# Altium schematic sheet Nmos.SchDoc
size A4; SheetNumber: 2; SheetTotal: 2
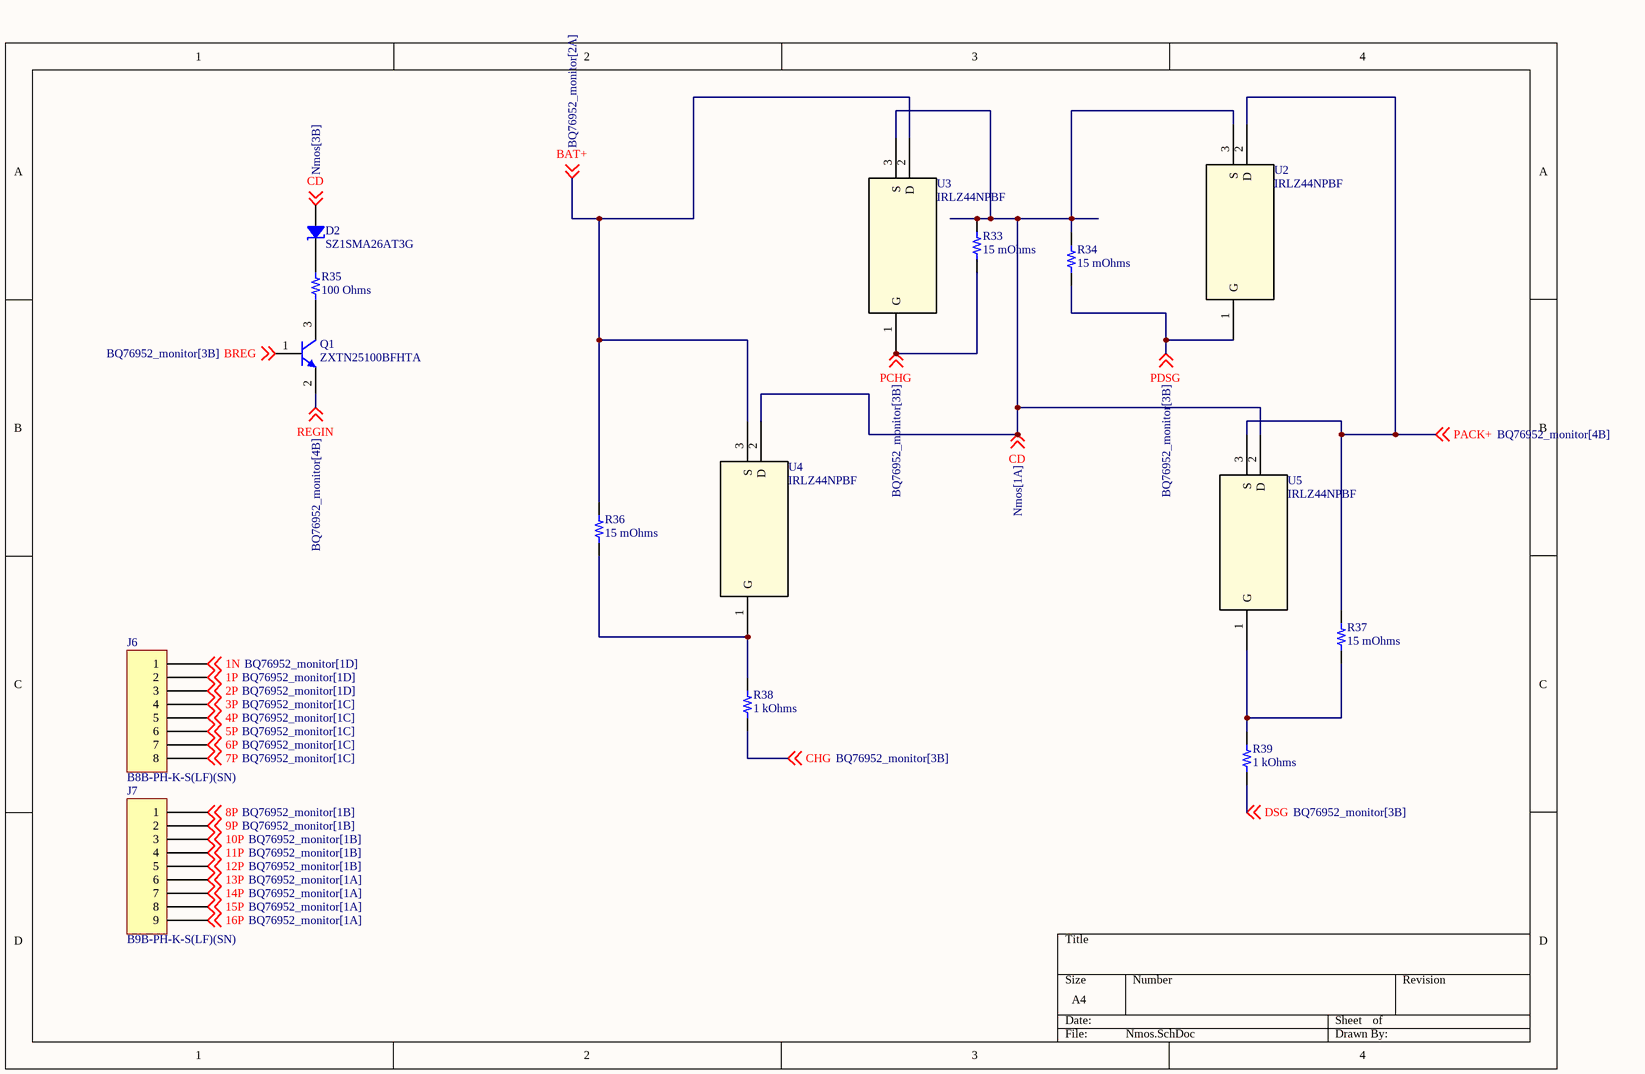
[diagram p0: Nmos.SchDoc]

## Parts
D2  SZ1SMA26AT3G  [DO214AC SMA]
J6  B8B-PH-K-S(LF)(SN)  [JST B8B-PH-K]
J7  B9B-PH-K-S(LF)(SN)  [JST B9B-PH-K]
Q1  ZXTN25100BFHTA  [DIODES SOT-23-3]
R33  15 mOhms  [RES 1206_3216]
R34  15 mOhms  [RES 1206_3216]
R35  100 Ohms  [RES 1206_3216]
R36  15 mOhms  [RES 1206_3216]
R37  15 mOhms  [RES 1206_3216]
R38  1 kOhms  [RES 1206_3216]
R39  1 kOhms  [RES 1206_3216]
U2  IRLZ44NPBF  [PG-TO220-3_INF]
U3  IRLZ44NPBF  [PG-TO220-3_INF]
U4  IRLZ44NPBF  [PG-TO220-3_INF]
U5  IRLZ44NPBF  [PG-TO220-3_INF]

## Nets
1N: J6.1 ; off-sheet 1N
1P: J6.2 ; off-sheet 1P
2P: J6.3 ; off-sheet 2P
3P: J6.4 ; off-sheet 3P
4P: J6.5 ; off-sheet 4P
5P: J6.6 ; off-sheet 5P
6P: J6.7 ; off-sheet 6P
7P: J6.8 ; off-sheet 7P
8P: J7.1 ; off-sheet 8P
9P: J7.2 ; off-sheet 9P
10P: J7.3 ; off-sheet 10P
11P: J7.4 ; off-sheet 11P
12P: J7.5 ; off-sheet 12P
13P: J7.6 ; off-sheet 13P
14P: J7.7 ; off-sheet 14P
15P: J7.8 ; off-sheet 15P
16P: J7.9 ; off-sheet 16P
BAT+: R36.2 U3.2(D) U4.3(S) ; off-sheet BAT+
BREG: Q1.1(B) ; off-sheet BREG
CD: D2.1 R33.2 R34.2 U2.3(S) U3.3(S) U4.2(D) U5.2(D) ; off-sheet CD
CHG: R38.1 ; off-sheet CHG
DSG: R39.1 ; off-sheet DSG
PACK+: R37.2 U2.2(D) U5.3(S) ; off-sheet PACK+
PCHG: R33.1 U3.1(G) ; off-sheet PCHG
PDSG: R34.1 U2.1(G) ; off-sheet PDSG
REGIN: Q1.2(E) ; off-sheet REGIN
NetD2_2: D2.2 R35.2
NetQ1_3: Q1.3(C) R35.1
NetR36_1: R36.1 R38.2 U4.1(G)
NetR37_1: R37.1 R39.2 U5.1(G)

## Library data of the parts
D2 = SZ1SMA26AT3G: TVS DIODE 26VWM 42.1VC SMA; Manufacturer: Littelfuse Inc.; Capacitance @ Frequency: 460pF @ 1MHz; Current - Peak Pulse (10/1000µs): 9.5A; Power Line Protection: No; Power - Peak Pulse: 400W; Type: Zener; Unidirectional Channels: 1; Voltage - Breakdown (Min): 28.9V; Voltage - Clamping (Max) @ Ipp: 42.1V; Voltage - Reverse Standoff (Typ): 26V; Part Number: SZ1SMA26AT3G; Applications: Automotive; ComponentLink1Description: Datasheet; ComponentLink1URL: https://www.littelfuse.com/~/media/electronics/datasheets/tvs_diodes/littelfuse_tvs_diode_sz1smaxxa_datasheet.pdf.pdf; ComponentLink2Description: DigiKey Link; ComponentLink2URL: https://www.digikey.com/en/products/detail/littelfuse-inc/SZ1SMA26AT3G/3062915; LastUpdated: 3.06.2024 19:57:20; Lifecycle Status: Active; Minimum Order: 1; Mounting Type: Surface Mount; Operating Temperature: -65°C ~ 150°C (TJ); Package / Case: DO-214AC, SMA; Packaging: TapeAndReel; PartId: 5569; Part Status: Active; Price: 0.16; Series: SZ1SMA; Supplier 1: DigiKey; Supplier Part Number 1: F11514CT-ND; Supplier Device Package: SMA
J6 = B8B-PH-K-S(LF)(SN): CONN HEADER VERT 8POS 2MM; Manufacturer: JST Sales America Inc.; Contact Length - Mating: 0.130" (3.30mm); Contact Length - Post: 0.134" (3.40mm); Current Rating (Amps): 2A; Material Flammability Rating: UL94 V-0; Number of Positions: 8; Number of Positions Loaded: All; Overall Contact Length: 0.333" (8.45mm); Pitch - Mating: 0.079" (2.00mm); Shrouding: Shrouded - 4 Wall; Style: Board to Cable/Wire; Voltage Rating: 100V; Part Number: B8B-PH-K-S(LF)(SN); ComponentLink1Description: Datasheet; ComponentLink1URL: http://www.jst-mfg.com/product/pdf/eng/ePH.pdf; ComponentLink2Description: DigiKey Link; ComponentLink2URL: http://digikey.com/product-detail/en/jst-sales-america-inc/B8B-PH-K-S-LF-SN/455-1710-ND/926617; Connector Type: Header; Contact Finish - Mating: Tin; Contact Finish - Post: Tin; Contact Material: Brass; Contact Shape: Square; Contact Type: Male Pin; Fastening Type: Detent Lock; Insulation Color: Natural; Insulation Height: 0.236" (6.00mm); Insulation Material: Polyamide (PA66), Nylon 6/6; LastUpdated: 12.01.2020 22:30:45; Lifecycle Status: Active; Minimum Order: 1; Mounting Type: Through Hole; Number of Rows: 1; Operating Temperature: -25°C ~ 85°C; Packaging: Bulk; PartId: 31; Part Status: Active; Price: 0.43; Series: PH; Supplier 1: DigiKey; Supplier Part Number 1: 455-1710-ND; Termination: Press-Fit, Solder
J7 = B9B-PH-K-S(LF)(SN): CONN HEADER VERT 9POS 2MM; Manufacturer: JST Sales America Inc.; Contact Length - Mating: 0.130" (3.30mm); Contact Length - Post: 0.134" (3.40mm); Current Rating (Amps): 2A; Material Flammability Rating: UL94 V-0; Number of Positions: 9; Number of Positions Loaded: All; Overall Contact Length: 0.333" (8.45mm); Pitch - Mating: 0.079" (2.00mm); Shrouding: Shrouded - 4 Wall; Style: Board to Cable/Wire; Voltage Rating: 100V; Part Number: B9B-PH-K-S(LF)(SN); ComponentLink1Description: Datasheet; ComponentLink1URL: http://www.jst-mfg.com/product/pdf/eng/ePH.pdf; ComponentLink2Description: DigiKey Link; ComponentLink2URL: http://digikey.com/product-detail/en/jst-sales-america-inc/B9B-PH-K-S-LF-SN/455-1711-ND/926618; Connector Type: Header; Contact Finish - Mating: Tin; Contact Finish - Post: Tin; Contact Material: Brass; Contact Shape: Square; Contact Type: Male Pin; Fastening Type: Detent Lock; Insulation Color: Natural; Insulation Height: 0.236" (6.00mm); Insulation Material: Polyamide (PA66), Nylon 6/6; LastUpdated: 12.01.2020 22:30:56; Lifecycle Status: Active; Minimum Order: 1; Mounting Type: Through Hole; Number of Rows: 1; Operating Temperature: -25°C ~ 85°C; Packaging: Bulk; PartId: 32; Part Status: Active; Price: 0.48; Series: PH; Supplier 1: DigiKey; Supplier Part Number 1: 455-1711-ND; Termination: Press-Fit, Solder
Q1 = ZXTN25100BFHTA: TRANS NPN 100V 3A SOT23-3; Manufacturer: Diodes Incorporated; Current - Collector Cutoff (Max): 50nA (ICBO); DC Current Gain (hFE) (Min) @ Ic, Vce: 100 @ 10mA, 2V; Frequency - Transition: 160MHz; Power - Max: 1.25 W; Vce Saturation (Max) @ Ib, Ic: 250mV @ 300mA, 3A; Part Number: ZXTN25100BFHTA; ComponentLink1Description: Datasheet; ComponentLink1URL: https://www.diodes.com/assets/Datasheets/ZXTN25100BFH.pdf; ComponentLink2Description: DigiKey Link; ComponentLink2URL: https://www.digikey.com/en/products/detail/diodes-incorporated/ZXTN25100BFHTA/1043596; Current - Collector (Ic) (Max): 3 A; LastUpdated: 3.06.2024 20:24:10; Lifecycle Status: Active; Minimum Order: 1; Mounting Type: Surface Mount; Operating Temperature: -55°C ~ 150°C (TJ); Package / Case: TO-236-3, SC-59, SOT-23-3; Packaging: TapeAndReel; PartId: 55; Part Status: Active; Price: 0.19; Series: -; Supplier 1: DigiKey; Supplier Part Number 1: ZXTN25100BFHCT-ND; Supplier Device Package: SOT-23-3; Transistor Type: NPN; Voltage - Collector Emitter Breakdown (Max): 100 V
R33 R34 R36 R37 = TLR2BPDTD15L0F75: RES 15M OHM 1% 1.5W 1206; Manufacturer: KOA Speer Electronics, Inc.; Temperature Coefficient: ±75ppm/°C; Part Number: TLR2BPDTD15L0F75; ComponentLink1Description: Datasheet; ComponentLink1URL: https://www.koaspeer.com/pdfs/TLR-2BW-2BP-2HW-3AP-3APS.pdf; ComponentLink2Description: DigiKey Link; ComponentLink2URL: https://www.digikey.com/en/products/detail/koa-speer-electronics-inc/TLR2BPDTD15L0F75/9856580; Composition: Metal Element; Device Package: 1206 (3216 Metric); Features: Automotive AEC-Q200, Current Sense; Height - Seated (Max): 0.032" (0.80mm); LastUpdated: 9.02.2024 20:53:01; Lifecycle Status: Active; Minimum Order: 1; Number of Terminations: 2; Operating Temperature: -65°C ~ 170°C; Package / Case: 1206 (3216 Metric); Packaging: TapeAndReel; PartId: 72235; Part Status: Active; Power (Watts): 1.5W; Price: 0.27; Ratings: AEC-Q200; Resistance: 15 mOhms; Series: TLR; Size / Dimension: 0.126" L x 0.063" W (3.20mm x 1.60mm); Supplier 1: DigiKey; Supplier Part Number 1: 2019-TLR2BPDTD15L0F75CT-ND; Supplier Device Package: 1206; Tolerance: ±1%; Value: 15 mOhms
R35 = RNCS1206BKE100R: RES 100 OHM 0.1% 1/8W 1206; Manufacturer: Stackpole Electronics Inc; Power (Watts): 0.125W, 1/8W; Temperature Coefficient: ±25ppm/°C; Part Number: RNCS1206BKE100R; ComponentLink1Description: Datasheet; ComponentLink1URL: https://www.seielect.com/catalog/sei-rncs_rnch.pdf; ComponentLink2Description: DigiKey Link; ComponentLink2URL: https://www.digikey.com/en/products/detail/stackpole-electronics-inc/RNCS1206BKE100R/1800111; Composition: Thin Film; Device Package: 1206 (3216 Metric); Features: Anti-Corrosive, Automotive AEC-Q200, Moisture Resistant; Height - Seated (Max): 0.026" (0.65mm); LastUpdated: 9.02.2024 20:54:46; Lifecycle Status: Active; Minimum Order: 1; Number of Terminations: 2; Operating Temperature: -55°C ~ 155°C; Package / Case: 1206 (3216 Metric); Packaging: TapeAndReel; PartId: 26857; Part Status: Active; Price: 0.08; Ratings: AEC-Q200; Resistance: 100 Ohms; Series: RNCS; Size / Dimension: 0.120" L x 0.061" W (3.05mm x 1.55mm); Supplier 1: DigiKey; Supplier Part Number 1: RNCS1206BKE100RCT-ND; Supplier Device Package: 1206; Tolerance: ±0.1%; Value: 100 Ohms
R38 R39 = CRGCQ1206F1K0: RES 1K OHM 1% 1/4W 1206; Manufacturer: TE Connectivity Passive Product; Power (Watts): 0.25W, 1/4W; Temperature Coefficient: ±100ppm/°C; Part Number: CRGCQ1206F1K0; ComponentLink1Description: Datasheet; ComponentLink1URL: https://www.te.com/commerce/DocumentDelivery/DDEController?Action=srchrtrv&DocNm=1773204-3&DocType=DS&DocLang=English; ComponentLink2Description: DigiKey Link; ComponentLink2URL: https://www.digikey.com/en/products/detail/te-connectivity-passive-product/CRGCQ1206F1K0/8576412; Composition: Thick Film; Device Package: 1206 (3216 Metric); Features: Automotive AEC-Q200, Moisture Resistant; Height - Seated (Max): 0.026" (0.65mm); LastUpdated: 9.02.2024 20:54:44; Lifecycle Status: Active; Minimum Order: 1; Number of Terminations: 2; Operating Temperature: -55°C ~ 155°C; Package / Case: 1206 (3216 Metric); Packaging: TapeAndReel; PartId: 26993; Part Status: Active; Price: 0.01; Ratings: AEC-Q200; Resistance: 1 kOhms; Series: CRGCQ; Size / Dimension: 0.122" L x 0.061" W (3.10mm x 1.55mm); Supplier 1: DigiKey; Supplier Part Number 1: A129810CT-ND; Supplier Device Package: 1206; Tolerance: ±1%; Value: 1 kOhms
U2-U5 = IRLZ44NPBF: No Description Available; Mfr_Name: Infineon; RefDes: RefDes; Type: Type